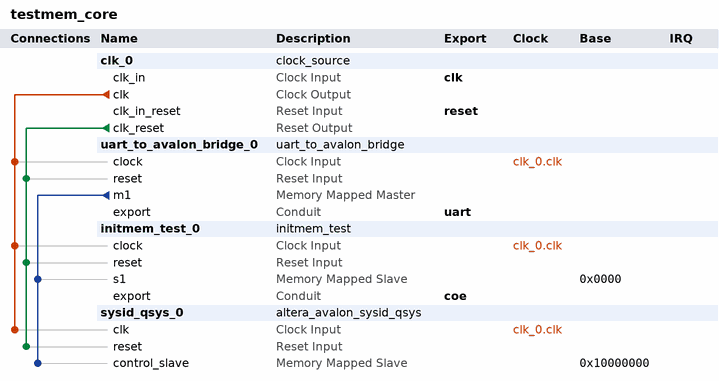
[diagram p0: system contents]
# Platform Designer (Qsys) system testmem_core, MAX 10 10M02DCV36C8G
# Parameters at their usual value, and those the tool derives, are not listed.
package require -exact qsys 16.0
create_system testmem_core
set_project_property DEVICE_FAMILY {MAX 10}
set_project_property DEVICE 10M02DCV36C8G

add_instance clk_0 clock_source 16.0
set_instance_parameter_value clk_0 clockFrequency 50000000

add_instance uart_to_avalon_bridge_0 uart_to_avalon_bridge 0.9
set_instance_parameter_value uart_to_avalon_bridge_0 BOARD_SERIAL 115792089237315896974215000280141046412780991420696032767008671009702357186378
set_instance_parameter_value uart_to_avalon_bridge_0 CLOCK_FREQUENCY 50000000
set_instance_parameter_value uart_to_avalon_bridge_0 UART_BAUDRATE 115200

add_instance initmem_test_0 initmem_test 1.0

add_instance sysid_qsys_0 altera_avalon_sysid_qsys 16.0
set_instance_parameter_value sysid_qsys_0 id 1923717529

# connections
add_connection clk_0.clk initmem_test_0.clock clock
add_connection clk_0.clk sysid_qsys_0.clk clock
add_connection clk_0.clk uart_to_avalon_bridge_0.clock clock
add_connection clk_0.clk_reset initmem_test_0.reset reset
add_connection clk_0.clk_reset sysid_qsys_0.reset reset
add_connection clk_0.clk_reset uart_to_avalon_bridge_0.reset reset
add_connection uart_to_avalon_bridge_0.m1 initmem_test_0.s1 avalon
set_connection_parameter_value uart_to_avalon_bridge_0.m1/initmem_test_0.s1 baseAddress 0x0000
add_connection uart_to_avalon_bridge_0.m1 sysid_qsys_0.control_slave avalon
set_connection_parameter_value uart_to_avalon_bridge_0.m1/sysid_qsys_0.control_slave baseAddress 0x10000000

# exported interfaces
add_interface clk clock sink
set_interface_property clk EXPORT_OF clk_0.clk_in
add_interface coe conduit end
set_interface_property coe EXPORT_OF initmem_test_0.export
add_interface reset reset sink
set_interface_property reset EXPORT_OF clk_0.clk_in_reset
add_interface uart conduit end
set_interface_property uart EXPORT_OF uart_to_avalon_bridge_0.export

set_interconnect_requirement {$system} qsys_mm.clockCrossingAdapter HANDSHAKE
set_interconnect_requirement {$system} qsys_mm.enableEccProtection FALSE
set_interconnect_requirement {$system} qsys_mm.insertDefaultSlave FALSE
set_interconnect_requirement {$system} qsys_mm.maxAdditionalLatency 1

save_system testmem_core.qsys
